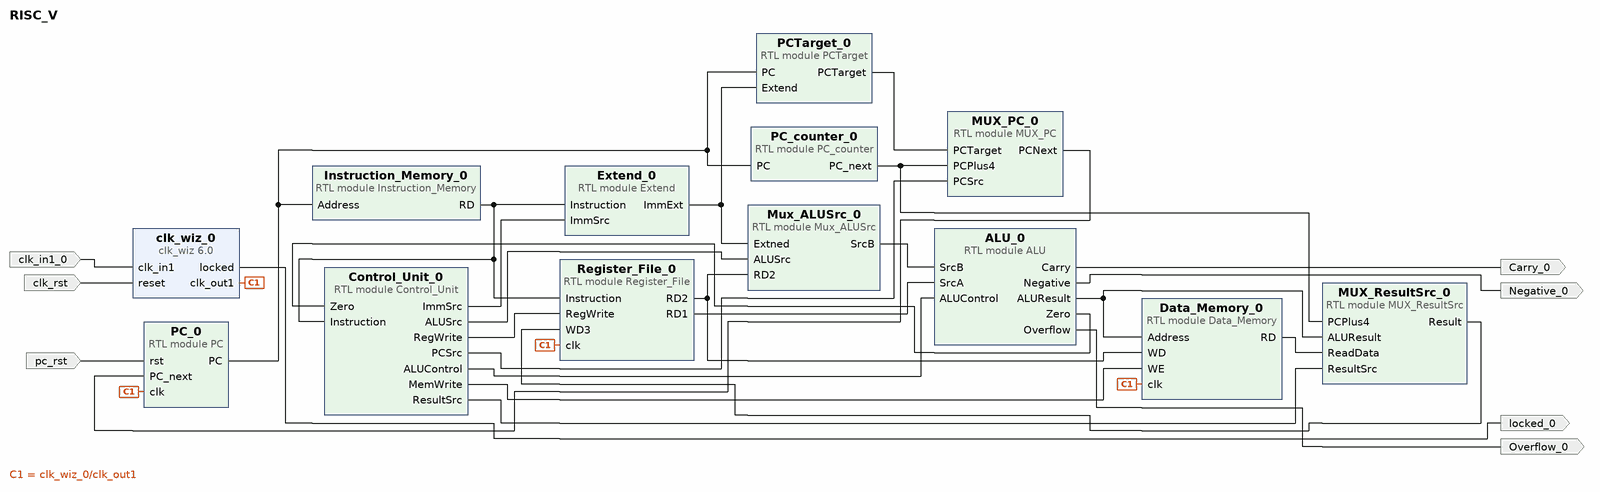
[diagram p0: block diagram of the top level]
# Vivado block design RISC_V, xc7a12ticsg325-1L, Vivado 2025.2
create_bd_design RISC_V

create_bd_port -dir O locked_0
create_bd_port -dir I -type clk clk_in1_0
create_bd_port -dir O Carry_0
create_bd_port -dir O Overflow_0
create_bd_port -dir O Negative_0
create_bd_port -dir I -type rst clk_rst
set_property -dict {CONFIG.POLARITY ACTIVE_HIGH} [get_bd_ports clk_rst]
create_bd_port -dir I -type rst pc_rst
set_property -dict {CONFIG.POLARITY ACTIVE_HIGH} [get_bd_ports pc_rst]

create_bd_cell -type module -reference Control_Unit Control_Unit_0
create_bd_cell -type module -reference ALU ALU_0
create_bd_cell -type module -reference Data_Memory Data_Memory_0
create_bd_cell -type module -reference Extend Extend_0
create_bd_cell -type module -reference Instruction_Memory Instruction_Memory_0
create_bd_cell -type module -reference MUX_PC MUX_PC_0
create_bd_cell -type module -reference MUX_ResultSrc MUX_ResultSrc_0
create_bd_cell -type module -reference Mux_ALUSrc Mux_ALUSrc_0
create_bd_cell -type module -reference PC PC_0
create_bd_cell -type module -reference PCTarget PCTarget_0
create_bd_cell -type module -reference PC_counter PC_counter_0
create_bd_cell -type module -reference Register_File Register_File_0
create_bd_cell -type ip -vlnv xilinx.com:ip:clk_wiz:6.0 clk_wiz_0

# ---- connections ----

connect_bd_net [get_bd_pins ALU_0/ALUResult] [get_bd_pins MUX_ResultSrc_0/ALUResult] [get_bd_pins Data_Memory_0/Address]
connect_bd_net [get_bd_pins ALU_0/Carry] [get_bd_ports Carry_0]
connect_bd_net [get_bd_pins ALU_0/Negative] [get_bd_ports Negative_0]
connect_bd_net [get_bd_pins ALU_0/Overflow] [get_bd_ports Overflow_0]
connect_bd_net [get_bd_pins ALU_0/Zero] [get_bd_pins Control_Unit_0/Zero]
connect_bd_net [get_bd_pins Control_Unit_0/ALUControl] [get_bd_pins ALU_0/ALUControl]
connect_bd_net [get_bd_pins Control_Unit_0/ALUSrc] [get_bd_pins Mux_ALUSrc_0/ALUSrc]
connect_bd_net [get_bd_pins Control_Unit_0/ImmSrc] [get_bd_pins Extend_0/ImmSrc]
connect_bd_net [get_bd_pins Control_Unit_0/MemWrite] [get_bd_pins Data_Memory_0/WE]
connect_bd_net [get_bd_pins Control_Unit_0/PCSrc] [get_bd_pins MUX_PC_0/PCSrc]
connect_bd_net [get_bd_pins Control_Unit_0/RegWrite] [get_bd_pins Register_File_0/RegWrite]
connect_bd_net [get_bd_pins Control_Unit_0/ResultSrc] [get_bd_pins MUX_ResultSrc_0/ResultSrc]
connect_bd_net [get_bd_pins Data_Memory_0/RD] [get_bd_pins MUX_ResultSrc_0/ReadData]
connect_bd_net [get_bd_pins Extend_0/ImmExt] [get_bd_pins Mux_ALUSrc_0/Extned] [get_bd_pins PCTarget_0/Extend]
connect_bd_net [get_bd_pins Instruction_Memory_0/RD] \
  [get_bd_pins Extend_0/Instruction] [get_bd_pins Register_File_0/Instruction] [get_bd_pins Control_Unit_0/Instruction]
connect_bd_net [get_bd_pins MUX_PC_0/PCNext] [get_bd_pins PC_0/PC_next]
connect_bd_net -net MUX_ResultSrc_0_WD [get_bd_pins MUX_ResultSrc_0/Result] [get_bd_pins Register_File_0/WD3]
connect_bd_net [get_bd_pins Mux_ALUSrc_0/SrcB] [get_bd_pins ALU_0/SrcB]
connect_bd_net [get_bd_pins PCTarget_0/PCTarget] [get_bd_pins MUX_PC_0/PCTarget]
connect_bd_net [get_bd_pins PC_0/PC] [get_bd_pins PC_counter_0/PC] [get_bd_pins PCTarget_0/PC] [get_bd_pins Instruction_Memory_0/Address]
connect_bd_net [get_bd_pins PC_counter_0/PC_next] [get_bd_pins MUX_PC_0/PCPlus4] [get_bd_pins MUX_ResultSrc_0/PCPlus4]
connect_bd_net [get_bd_pins Register_File_0/RD1] [get_bd_pins ALU_0/SrcA]
connect_bd_net [get_bd_pins Register_File_0/RD2] [get_bd_pins Mux_ALUSrc_0/RD2] [get_bd_pins Data_Memory_0/WD]
connect_bd_net -net clk_in1_0_1 [get_bd_ports clk_in1_0] [get_bd_pins clk_wiz_0/clk_in1]
connect_bd_net [get_bd_pins clk_wiz_0/clk_out1] [get_bd_pins PC_0/clk] [get_bd_pins Register_File_0/clk] [get_bd_pins Data_Memory_0/clk]
connect_bd_net [get_bd_pins clk_wiz_0/locked] [get_bd_ports locked_0]
connect_bd_net -net reset_0_1 [get_bd_ports clk_rst] [get_bd_pins clk_wiz_0/reset]
connect_bd_net -net rst_0_1 [get_bd_ports pc_rst] [get_bd_pins PC_0/rst]

validate_bd_design
save_bd_design
